# EAGLE design energy-management-input (EAGLE 6.3)
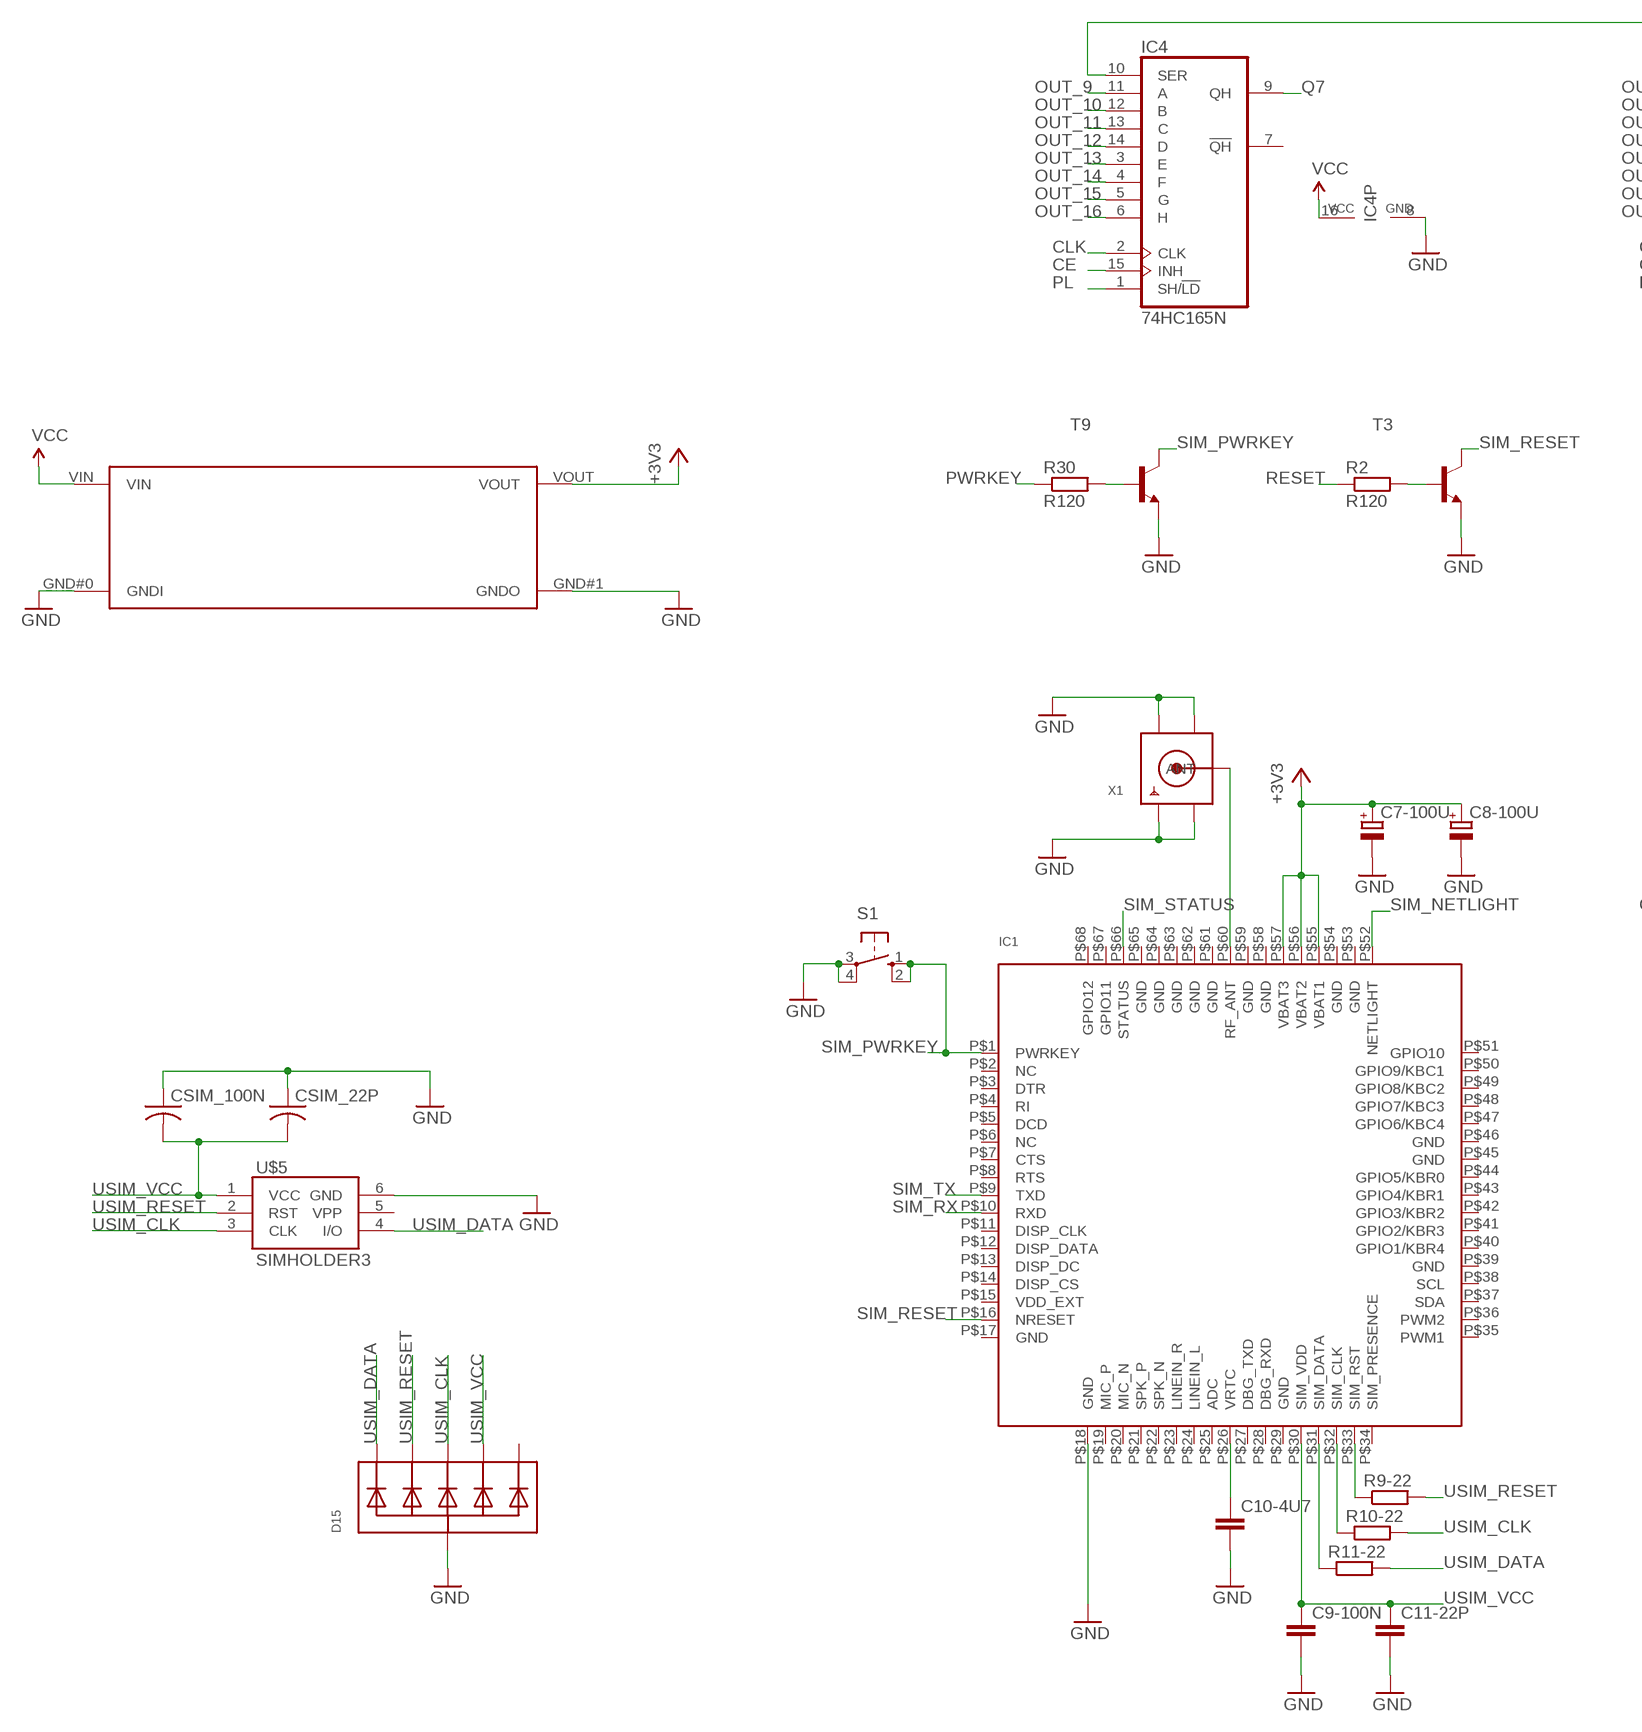
[diagram p0: schematic, sheet 1, part 1 of 2]
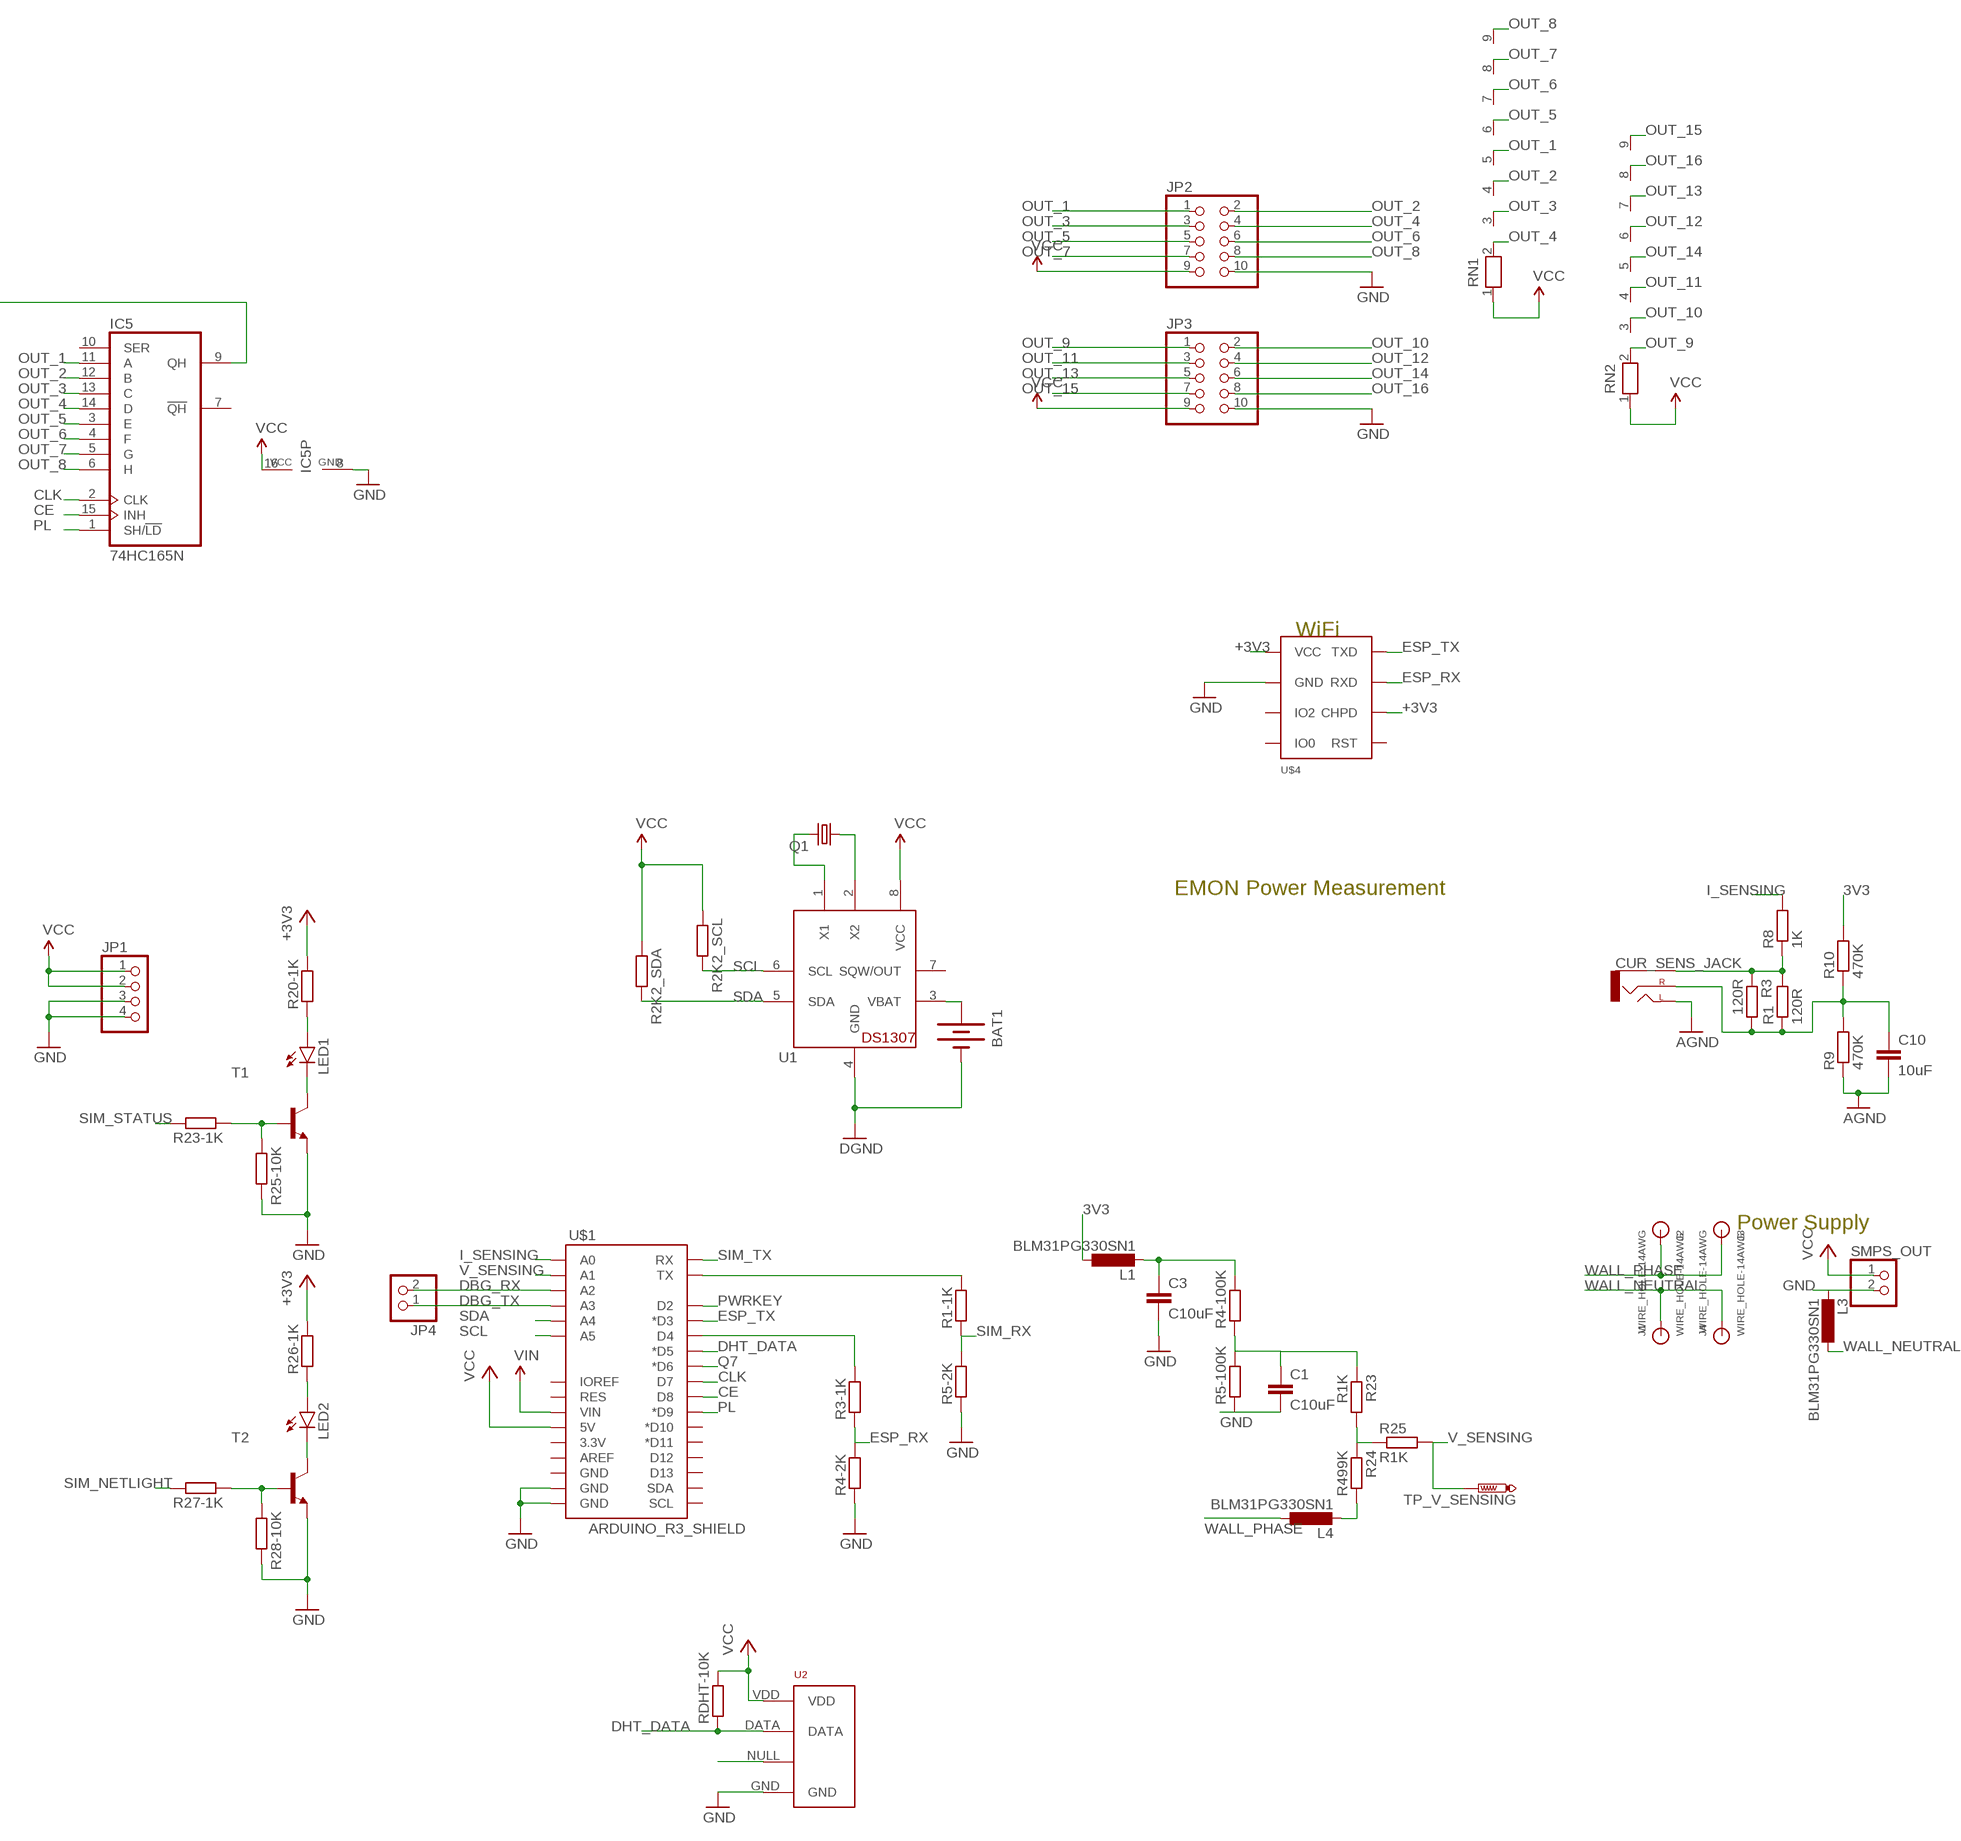
[diagram p1: schematic, sheet 1, part 2 of 2]

## Parts
BAT1  BATTERY20PTH  [BATTCOM_20MM_PTH]
C1  C10uF  C-EUC0805  [C0805]
C3  C10uF  C-EUC0805  [C0805]
C7-100U  CPOL-EU153CLV-0605  [153CLV-0605]
C8-100U  CPOL-EU153CLV-0605  [153CLV-0605]
C9-100N  C-EUC0603  [C0603]
C10  10uF  C-EUC0805  [C0805]
C10-4U7  C-EUC0603  [C0603]
C11-22P  C-EUC0603  [C0603]
CSIM_22P  C-USC0603K  [C0603K]
CSIM_100N  C-USC0603K  [C0603K]
CUR_SENS_JACK  AUDIO-JACKSMD2  [AUDIO-JACK-3.5MM-SMD]
D15  TVSARRAY_5LANE  [SOT363]
IC1  GSM_SIM900_LITERAL  [SIM900_SMT]
IC4  74HC165N  [DIL16]
IC5  74HC165N  [DIL16]
J1  WIRE_HOLE-14AWG  [WIRE_HOLE-14AWG]
J2  WIRE_HOLE-14AWG  [WIRE_HOLE-14AWG]
J3  WIRE_HOLE-14AWG  [WIRE_HOLE-14AWG]
J4  WIRE_HOLE-14AWG  [WIRE_HOLE-14AWG]
JP1  PINHD-1X4  [1X04]
JP2  PINHD-2X5  [2X05]
JP3  PINHD-2X5  [2X05]
JP4  PINHD-1X2  [1X02]
L1  BLM31PG330SN1  L-EUL3216C  [L3216C]
L3  BLM31PG330SN1  L-EUL3216C  [L3216C]
L4  BLM31PG330SN1  L-EUL3216C  [L3216C]
LED1  LED-3MM-NO_SILK  [LED3MM-NS]
LED2  LED-3MM-NO_SILK  [LED3MM-NS]
Q1  CRYSTALTC26H  [TC26H]
R1  120R  R-EU_0204/7  [0204/7]
R1-1K  R-EU_R0603  [R0603]
R2  R120  R-EU_M0805  [M0805]
R2K2_SCL  R-EU_R0603  [R0603]
R2K2_SDA  R-EU_R0603  [R0603]
R3  120R  R-EU_R1206  [R1206]
R3-1K  R-EU_R0603  [R0603]
R4-2K  R-EU_R0603  [R0603]
R4-100K  R-EU_R0805  [R0805]
R5-2K  R-EU_R0603  [R0603]
R5-100K  R-EU_R0805  [R0805]
R8  1K  R-EU_R0805  [R0805]
R9  470K  R-EU_R0805  [R0805]
R9-22  R-EU_R0603  [R0603]
R10  470K  R-EU_R0805  [R0805]
R10-22  R-EU_R0603  [R0603]
R11-22  R-EU_R0603  [R0603]
R20-1K  R-EU_R0603  [R0603]
R23  R1K  R-EU_R0805  [R0805]
R23-1K  R-EU_R0603  [R0603]
R24  R499K  R-EU_R0805  [R0805]
R25  R1K  R-EU_R0805  [R0805]
R25-10K  R-EU_R0603  [R0603]
R26-1K  R-EU_R0603  [R0603]
R27-1K  R-EU_R0603  [R0603]
R28-10K  R-EU_R0603  [R0603]
R30  R120  R-EU_M0805  [M0805]
RDHT-10K  R-EU_R0603  [R0603]
RN1  RN08  [RN-9]
RN2  RN08  [RN-9]
S1  10-XX  [B3F-10XX]
SMPS_OUT  PINHD-1X2  [1X02]
T1  MMBT2222ALT1-NPN-SOT23-BEC  [SOT23-BEC]
T2  MMBT2222ALT1-NPN-SOT23-BEC  [SOT23-BEC]
T3  MMBT2222ALT1-NPN-SOT23-BEC  [SOT23-BEC]
T9  MMBT2222ALT1-NPN-SOT23-BEC  [SOT23-BEC]
TP_V_SENSING  PTR1PAD1-13  [P1-13]
U1  DS1307  [DIL08]
U2  RHT03_DHT-22_AM2302  [RHT03_DHT-22]
U$1  ARDUINO_R3_SHIELD  [UNO_R3_SHIELD]
U$2  DCDCMODULE  [DCDCMODULE]
U$4  ESP8266  [ESP8266]
U$5  SIMHOLDER3  [SIMHOLDER3]
X1  SMACONNECTOR  [SMA90_DIP]

## Nets
3V3: L1.1 R10.2
+3V3: C7-100U.+ C8-100U.+ IC1.P$55(VBAT1) IC1.P$56(VBAT2) IC1.P$57(VBAT3) R20-1K.2 R26-1K.2 U$2.VOUT U$4.CHPD U$4.VCC
AGND [gnd]: C10.2 CUR_SENS_JACK.TIP(LEFT) R9.1
CE: IC4.15(INH) IC5.15(INH) U$1.D8
CLK: IC4.2(CLK) IC5.2(CLK) U$1.D7
DBG_RX: JP4.2 U$1.A2
DBG_TX: JP4.1 U$1.A3
DHT_DATA: RDHT-10K.1 U2.DATA U$1.D5(*D5)
ESP_RX: R3-1K.1 R4-2K.2 U$4.RXD
ESP_TX: U$1.D3(*D3) U$4.TXD
GND: BAT1.2(-) C1.2 C3.2 C7-100U.- C8-100U.- C9-100N.2 C10-4U7.2 C11-22P.2 CSIM_22P.1 CSIM_100N.1 D15.2(A) IC1.P$18(GND) IC4.8(GND) IC5.8(GND) JP1.3 JP1.4 JP2.10 JP3.10 L3.2 R4-2K.1 R5-2K.1 R5-100K.1 R25-10K.2 R28-10K.2 S1.3(P) S1.4(P1) SMPS_OUT.2 T1.E T2.E T3.E T9.E U1.4(GND) U2.GND U$1.GND@0(GND) U$1.GND@1(GND) U$2.GND#0(GNDI) U$2.GND#1(GNDO) U$4.GND U$5.6(GND) X1.GND1 X1.GND2 X1.GND3 X1.GND4 ; supply symbol labelled DGND
I_SENSING: R8.2 U$1.A0
N$1: C3.1 L1.2 R4-100K.2
N$2: IC1.P$31(SIM_DATA) R11-22.1
N$3: IC1.P$32(SIM_CLK) R10-22.1
N$4: IC1.P$33(SIM_RST) R9-22.1
N$5: C10-4U7.1 IC1.P$26(VRTC)
N$6: IC1.P$60(RF_ANT) X1.ANTENNA(ANT)
N$7: R1-1K.2 U$1.TX
N$8: LED1.A R20-1K.1
N$9: LED1.K(C) T1.C
N$10: R23-1K.1 R25-10K.1 T1.B
N$11: LED2.A R26-1K.1
N$12: LED2.K(C) T2.C
N$13: R27-1K.1 R28-10K.1 T2.B
N$14: R30.2 T9.B
N$15: R2.2 T3.B
N$16: Q1.1 U1.2(X2)
N$17: R3-1K.2 U$1.D4
N$19: Q1.2 U1.1(X1)
N$20: C1.1 R4-100K.1 R5-100K.2 R23.1
N$21: R23.2 R24.1 R25.1
N$22: L4.2 R24.2
N$23: BAT1.1(+) U1.3(VBAT)
N$25: CUR_SENS_JACK.SLEEVE R1.2 R3.1 R8.1
N$26: C10.1 CUR_SENS_JACK.RING(RIGHT) R1.1 R3.2 R9.2 R10.1
N$32: U2.NULL
N$50: IC4.10(SER) IC5.9(QH)
OUT_1: IC5.11(A) JP2.1 RN1.5
OUT_2: IC5.12(B) JP2.2 RN1.4
OUT_3: IC5.13(C) JP2.3 RN1.3
OUT_4: IC5.14(D) JP2.4 RN1.2
OUT_5: IC5.3(E) JP2.5 RN1.6
OUT_6: IC5.4(F) JP2.6 RN1.7
OUT_7: IC5.5(G) JP2.7 RN1.8
OUT_8: IC5.6(H) JP2.8 RN1.9
OUT_9: IC4.11(A) JP3.1 RN2.2
OUT_10: IC4.12(B) JP3.2 RN2.3
OUT_11: IC4.13(C) JP3.3 RN2.4
OUT_12: IC4.14(D) JP3.4 RN2.6
OUT_13: IC4.3(E) JP3.5 RN2.7
OUT_14: IC4.4(F) JP3.6 RN2.5
OUT_15: IC4.5(G) JP3.7 RN2.9
OUT_16: IC4.6(H) JP3.8 RN2.8
PL: IC4.1(SH/!LD) IC5.1(SH/!LD) U$1.D9(*D9)
PWRKEY: R30.1 U$1.D2
Q7: IC4.9(QH) U$1.D6(*D6)
RESET: R2.1
SCL: R2K2_SCL.2 U1.6(SCL) U$1.A5
SDA: R2K2_SDA.2 U1.5(SDA) U$1.A4
SIM_NETLIGHT: IC1.P$52(NETLIGHT) R27-1K.2
SIM_PWRKEY: IC1.P$1(PWRKEY) S1.1(S) S1.2(S1) T9.C
SIM_RESET: IC1.P$16(NRESET) T3.C
SIM_RX: IC1.P$10(RXD) R1-1K.1 R5-2K.2
SIM_STATUS: IC1.P$66(STATUS) R23-1K.2
SIM_TX: IC1.P$9(TXD) U$1.RX
USIM_CLK: D15.4(C3) R10-22.2 U$5.3(CLK)
USIM_DATA: D15.1(C1) R11-22.2 U$5.4(I/O)
USIM_RESET: D15.3(C2) R9-22.2 U$5.2(RST)
USIM_VCC: C9-100N.1 C11-22P.1 CSIM_22P.2 CSIM_100N.2 D15.5(C4) IC1.P$30(SIM_VDD) U$5.1(VCC)
V_SENSING: R25.2 TP_V_SENSING.TP U$1.A1
VCC: IC4.16(VCC) IC5.16(VCC) JP1.1 JP1.2 JP2.9 JP3.9 R2K2_SCL.1 R2K2_SDA.1 RDHT-10K.2 RN1.1 RN2.1 SMPS_OUT.1 U1.8(VCC) U2.VDD U$1.5V U$2.VIN
VIN: U$1.VIN
WALL_NEUTRAL: J1.P$1 J4.P$1 L3.1
WALL_PHASE: J2.P$1 J3.P$1 L4.1
Unconnected: D15.6(C5) IC1.P$2(NC) IC1.P$3(DTR) IC1.P$4(RI) IC1.P$5(DCD) IC1.P$6(NC) IC1.P$7(CTS) IC1.P$8(RTS) IC1.P$11(DISP_CLK) IC1.P$12(DISP_DATA) IC1.P$13(DISP_DC) IC1.P$14(DISP_CS) IC1.P$15(VDD_EXT) IC1.P$19(MIC_P) IC1.P$20(MIC_N) IC1.P$21(SPK_P) IC1.P$22(SPK_N) IC1.P$23(LINEIN_R) IC1.P$24(LINEIN_L) IC1.P$25(ADC) IC1.P$27(DBG_TXD) IC1.P$28(DBG_RXD) IC1.P$34(SIM_PRESENCE) IC1.P$35(PWM1) IC1.P$36(PWM2) IC1.P$37(SDA) IC1.P$38(SCL) IC1.P$40(GPIO1/KBR4) IC1.P$41(GPIO2/KBR3) IC1.P$42(GPIO3/KBR2) IC1.P$43(GPIO4/KBR1) IC1.P$44(GPIO5/KBR0) IC1.P$47(GPIO6/KBC4) IC1.P$48(GPIO7/KBC3) IC1.P$49(GPIO8/KBC2) IC1.P$50(GPIO9/KBC1) IC1.P$51(GPIO10) IC4.7(!QH) IC5.7(!QH) IC5.10(SER) U1.7(SQW/OUT) U$1.3.3V U$1.AREF U$1.D10(*D10) U$1.D11(*D11) U$1.D12 U$1.D13 U$1.GND@2(GND) U$1.IOREF U$1.RES U$1.SCL U$1.SDA U$4.IO0 U$4.IO2 U$4.RST U$5.5(VPP)

## Notes on the sheet
- WiFi
- EMON Power Measurement
- Power Supply

## Power pins joined to a net without a drawn wire
GND: IC1.P$17(GND) IC1.P$29(GND) IC1.P$39(GND) IC1.P$45(GND) IC1.P$46(GND) IC1.P$53(GND) IC1.P$54(GND) IC1.P$58(GND) IC1.P$59(GND) IC1.P$61(GND) IC1.P$62(GND) IC1.P$63(GND) IC1.P$64(GND) IC1.P$65(GND)
GPIO11: IC1.P$67(GPIO11)
GPIO12: IC1.P$68(GPIO12)

## Library data of the parts
BAT1 = SparkFun-Electromechanical:BATTERY: Battery Holders Various common sizes : AA, AAA, 20mm coin cell and 12mm coin cell. 20MM_4LEGS, BATT-10373
C1 C3 C10 = resistor:C-EU: CAPACITOR, European symbol
C7-100U C8-100U = rcl:CPOL-EU: POLARIZED CAPACITOR, European symbol
C9-100N C10-4U7 C11-22P = rcl:C-EU: CAPACITOR, European symbol
CSIM_22P CSIM_100N = rcl:C-US: CAPACITOR, American symbol
CUR_SENS_JACK = SparkFun-Connectors:AUDIO-JACK: 3.5mm Audio Jack Simple 3.5mm common PCB mount audio jack. SKU: PRT-08032; PROD_ID: CONN-10353
D15 = microbuilder:TVSARRAY_5LANE: Voltage Transient Suppressor Array SOT363 SMF05C - 100W 5V: Digikey - SMF05CT1GOSCT-ND
IC1 = microbuilder:GSM_SIM900_LITERAL: SIM900 Quad-Band GSM/GPRS Module Power Supply: 3.2-4.8V Temperature Range: -30°C-+80°C Bands: GSM 850, EGSM 900, DCS 1800, PCS 1900
IC4 IC5 = 74xx-eu:74*165: 8-bit parallel load SHIFT REGISTER
J1-J4 = powercube:WIRE_HOLE-14AWG: Solder point for 14AWG wire
JP1 = pinhead:PINHD-1X4: PIN HEADER
JP2 JP3 = pinhead:PINHD-2X5: PIN HEADER
JP4 SMPS_OUT = pinhead:PINHD-1X2: PIN HEADER
L1 L3 L4 = resistor:L-EU: INDUCTOR, European symbol
LED1 LED2 = SparkFun-LED:LED: LEDs Standard schematic elements and footprints for 5mm, 3mm, 1206, and 0603 sized LEDs. 5mm - Spark Fun Electronics SKU : COM-00529 (and others)
Q1 = crystal:CRYSTAL: CRYSTAL; OC_FARNELL: unknown; OC_NEWARK: unknown
R1 R1-1K R2K2_SCL R2K2_SDA R3-1K R4-2K R5-2K R9-22 R10-22 R11-22 R20-1K R23-1K R25-10K R26-1K R27-1K R28-10K RDHT-10K = rcl:R-EU_: RESISTOR, European symbol
R2 R3 R4-100K R5-100K R8-R10 R23-R25 R30 = resistor:R-EU_: RESISTOR, European symbol
RN1 RN2 = resistor-net:RN08: RESISTOR NETWORK; OC_FARNELL: unknown; OC_NEWARK: unknown
S1 = switch-omron:10-XX: OMRON SWITCH; MPN: B3F-1000; OC_FARNELL: 176432; OC_NEWARK: 36M3542
T1 T2 = transistor:*-NPN-: NPN Transistror BF959 corrected 2008.03.06
T3 T9 = transistor-neu-to92:*-NPN-: NPN Transistror BF959 corrected 2008.03.06
TP_V_SENSING = testpad:PTR1: TEST PIN
U1 = adafruit:DS1307: DS1307 Real time clock (RTC) with battery backup ability. Talk to it via i2c
U2 = RHT03_DHT-22_AM2302:RHT03_DHT-22_AM2302: RHT03 / DHT-22 / AM2302 Packages and symbol for the RHT03 / DHT-22 relative humidity and temperature sensor. Note: The AM2302 is a wired version of the DHT-22 which typically requires less clearance and is thus provided as a separate package.; PROD_ID: SEN-10167
U$1 = SparkFun-Boards:ARDUINO_R3_SHIELD: Shield form compatible with the Arduino Uno R3.
U$2 = bontor:DCDCMODULE
U$4 = tigorcustom:ESP8266
U$5 = SparkFun:SIMHOLDER3
X1 = microbuilder:SMACONNECTOR: SMA Connector 90° DIP SMA Connector, 50 Ohm (4UConnector: 07259)

## Net classes
1 power: width 0.305 mm, drill 0.6 mm, clearance 0.254 mm
2 gnd: width 0.254 mm, drill 0.6 mm, clearance 0.254 mm

## Board
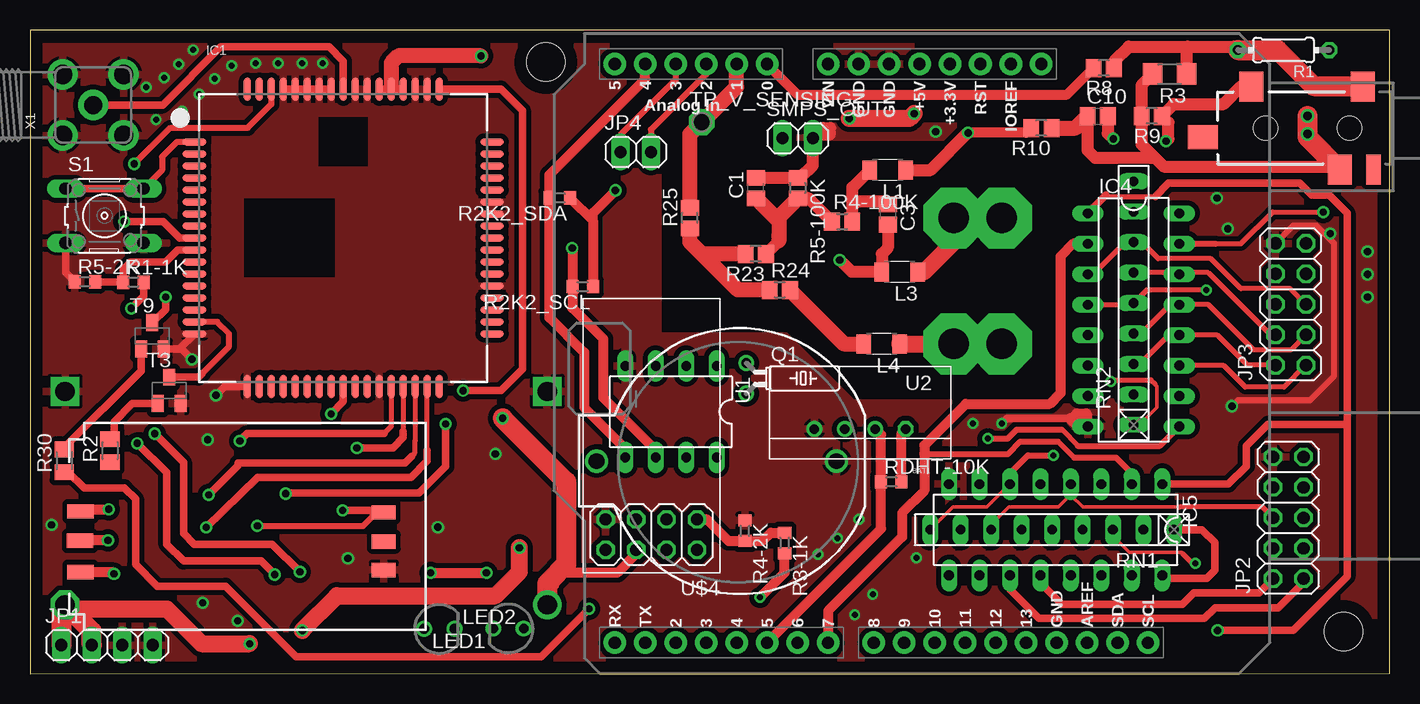
[diagram p2: board, top side]
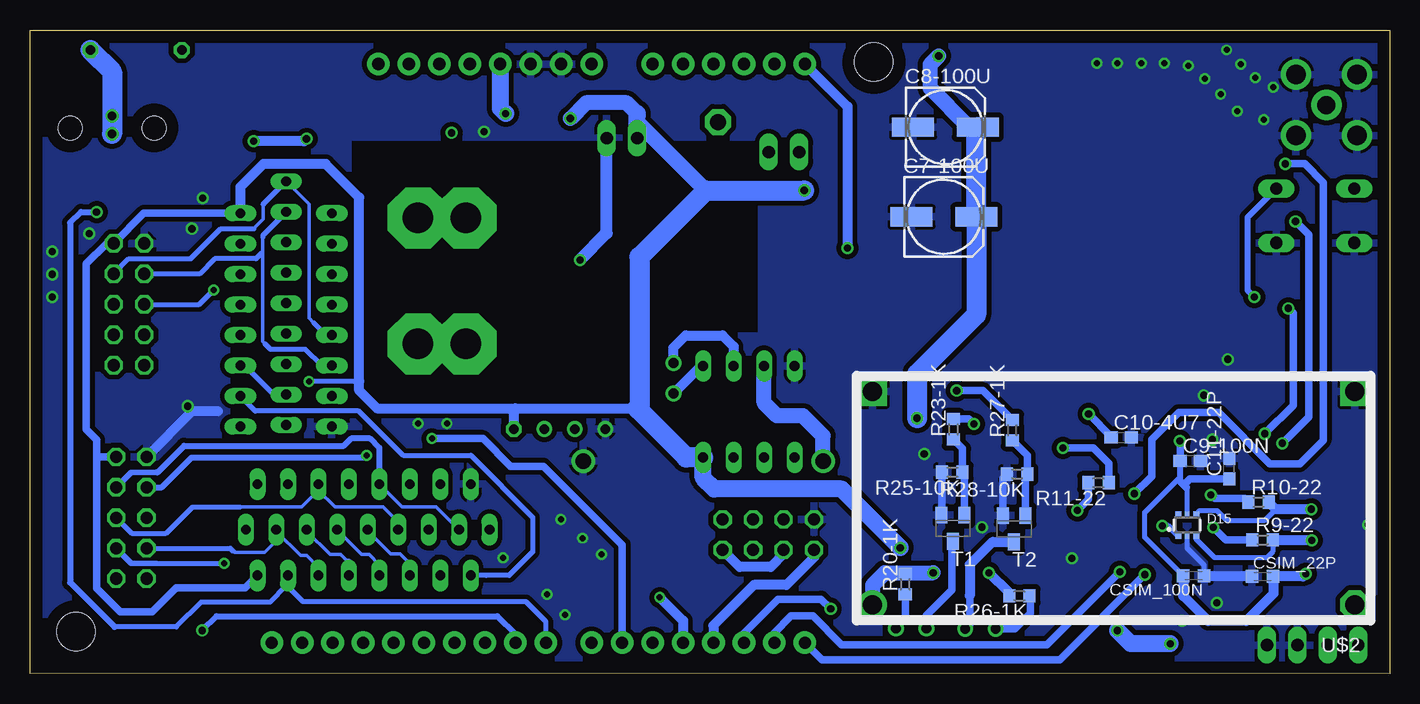
[diagram p3: board, bottom side, seen from below]

Size 113.35 x 53.66 mm. Coordinates in mm from the lower left corner, seen from the top.
Outline: 0,0 113.35,0.01 113.35,53.66 0,53.66 0,0
Copper layers (1*16): Top 0.035mm / dielectric 1.5mm / Bottom 0.035mm
Design rules "default": minimum track width 10mil, minimum drill 24mil, track to track 8mil, track to pad 8mil, pad to pad 8mil, via to via 8mil, smd to smd 8mil, copper to edge 40mil, drill to drill 8mil, minimum pad ring 10mil, minimum via ring 8mil, stop-mask expansion 4mil, vias tented up to drill 0mil, thermal gap 10mil
Holes 3.2 mm at 43,51 109.5,3.5

### Footprints (pad centres in the part's own frame; a part is rotated, then mirrored left to right if it is on the bottom)
BATTCOM_20MM_PTH = drill 1.3: 1 11.85,0; 2 -8.15,0
C0805 = smd 1.3 x 1.5: 1 -0.85,0; 2 0.85,0
153CLV-0605 = smd 3.5 x 1.6: + 2.7,0; - -2.7,0
C0603 = smd 1.1 x 1: 1 -0.85,0; 2 0.85,0
C0603K = smd 1.05 x 1.08: 1 -0.875,0; 2 0.875,0
AUDIO-JACK-3.5MM-SMD = smd 2 x 2.5: RING 4.3,3.45; SLEEVE 2.4,-3.45; TIP 11.7,-3.45 | smd 1.2 x 2.5: RSH 1.5,3.45 | smd 2.5 x 2: TSH 15.75,0.75 | hole 2: 3.5,0; 10.5,0
SOT363 = smd 0.5 x 0.5: 1 -0.75,-0.9; 3 0.75,-0.9; 4 0.75,0.9; 6 -0.75,0.9 | smd 0.4 x 0.5: 2 0,-0.9; 5 0,0.9
SIM900_SMT = smd 2 x 0.6: P$1 -12.4,8; P$2 -12.4,7; P$3 -12.4,6; P$4 -12.4,5; P$5 -12.4,4; P$6 -12.4,3; P$7 -12.4,2; P$8 -12.4,1; P$9 -12.4,0; P$10 -12.4,-1; P$11 -12.4,-2; P$12 -12.4,-3; P$13 -12.4,-4; P$14 -12.4,-5; P$15 -12.4,-6; P$16 -12.4,-7; P$17 -12.4,-8; P$35 12.4,-8; P$36 12.4,-7; P$37 12.4,-6; P$38 12.4,-5; P$39 12.4,-4; P$40 12.4,-3; P$41 12.4,-2; P$42 12.4,-1; P$43 12.4,0; P$44 12.4,1; P$45 12.4,2; P$46 12.4,3; P$47 12.4,4; P$48 12.4,5; P$49 12.4,6; P$50 12.4,7; P$51 12.4,8 | smd 0.6 x 2: P$18 -8,-12.4; P$19 -7,-12.4; P$20 -6,-12.4; P$21 -5,-12.4; P$22 -4,-12.4; P$23 -3,-12.4; P$24 -2,-12.4; P$25 -1,-12.4; P$26 0,-12.4; P$27 1,-12.4; P$28 2,-12.4; P$29 3,-12.4; P$30 4,-12.4; P$31 5,-12.4; P$32 6,-12.4; P$33 7,-12.4; P$34 8,-12.4; P$52 8,12.4; P$53 7,12.4; P$54 6,12.4; P$55 5,12.4; P$56 4,12.4; P$57 3,12.4; P$58 2,12.4; P$59 1,12.4; P$60 0,12.4; P$61 -1,12.4; P$62 -2,12.4; P$63 -3,12.4; P$64 -4,12.4; P$65 -5,12.4; P$66 -6,12.4; P$67 -7,12.4; P$68 -8,12.4
DIL16 = drill 0.813 long: 1 -8.89,-3.81; 2 -6.35,-3.81; 3 -3.81,-3.81; 4 -1.27,-3.81; 5 1.27,-3.81; 6 3.81,-3.81; 7 6.35,-3.81; 8 8.89,-3.81; 9 8.89,3.81; 10 6.35,3.81; 11 3.81,3.81; 12 1.27,3.81; 13 -1.27,3.81; 14 -3.81,3.81; 15 -6.35,3.81; 16 -8.89,3.81
WIRE_HOLE-14AWG = drill 2.54 pad 5.08 octagon: P$1 0,0
1X04 = drill 1.016 long: 1 -3.81,0; 2 -1.27,0; 3 1.27,0; 4 3.81,0
2X05 = drill 1.016 octagon: 1 -5.08,-1.27; 2 -5.08,1.27; 3 -2.54,-1.27; 4 -2.54,1.27; 5 0,-1.27; 6 0,1.27; 7 2.54,-1.27; 8 2.54,1.27; 9 5.08,-1.27; 10 5.08,1.27
1X02 = drill 1.016 long: 1 -1.27,0; 2 1.27,0
L3216C = smd 1.2 x 1.6: 1 -1.5,0; 2 1.5,0
LED3MM-NS = drill 0.813: A -1.27,0; K 1.27,0
TC26H = drill 0.813: 1 -1.27,0; 2 1.27,0
0204/7 = drill 0.813 octagon: 1 -3.81,0; 2 3.81,0
R0603 = smd 1 x 1.1: 1 -0.85,0; 2 0.85,0
M0805 = smd 1.3 x 1.6: 1 -0.95,0; 2 0.95,0
R1206 = smd 1.6 x 1.803: 1 -1.422,0; 2 1.422,0
R0805 = smd 1.3 x 1.5: 1 -0.85,0; 2 0.85,0
RN-9 = drill 0.813 long: 1 -10.16,0; 2 -7.62,0; 3 -5.08,0; 4 -2.54,0; 5 0,0; 6 2.54,0; 7 5.08,0; 8 7.62,0; 9 10.16,0
B3F-10XX = drill 1.016 long: 1 -3.251,2.261; 2 3.251,2.261; 3 -3.251,-2.261; 4 3.251,-2.261
SOT23-BEC = smd 1 x 1.4: B -0.95,-1.1; C 0,1.1; E 0.95,-1.1
P1-13 = drill 1.321 pad 2.159 octagon: TP 0,0
DIL08 = drill 0.813 long: 1 -3.81,-3.81; 2 -1.27,-3.81; 3 1.27,-3.81; 4 3.81,-3.81; 5 3.81,3.81; 6 1.27,3.81; 7 -1.27,3.81; 8 -3.81,3.81
RHT03_DHT-22 = drill 0.8: DATA -1.27,0; GND 3.81,0; NULL 1.27,0 | drill 0.8 octagon: VDD -3.81,0
UNO_R3_SHIELD = drill 1.016 pad 1.88: 3.3V 50.8,26.67; 5V 50.8,29.21; A0 50.8,41.91; A1 50.8,44.45; A2 50.8,46.99; A3 50.8,49.53; A4 50.8,52.07; A5 50.8,54.61; AREF 2.54,15.24; D2 2.54,49.53; D3 2.54,46.99; D4 2.54,44.45; D5 2.54,41.91; D6 2.54,39.37; D7 2.54,36.83; D8 2.54,33.02; D9 2.54,30.48; D10 2.54,27.94; D11 2.54,25.4; D12 2.54,22.86; D13 2.54,20.32; GND@0 50.8,31.75; GND@1 50.8,34.29; GND@2 2.54,17.78; IOREF 50.8,21.59; NC 50.8,19.05; RES 50.8,24.13; RX 2.54,54.61; SCL 2.54,10.16; SDA 2.54,12.7; TX 2.54,52.07; VIN 50.8,36.83
DCDCMODULE = drill 1.6 square: GND#0 1.7,1.7; GND#1 41.9,1.7 | drill 1.6 octagon: VIN 1.7,19.5 | drill 1.6: VOUT 41.9,19.5
ESP8266 = drill 1.016 octagon: CHPD 1.27,1.27; GND 3.81,-1.27; IO0 -1.27,-1.27; IO2 1.27,-1.27; RST -1.27,1.27; RXD -3.81,-1.27; TXD 3.81,1.27; VCC -3.81,1.27
SIMHOLDER3 = smd 2.2 x 1.2: 1 0.95,4.81; 2 0.91,7.41; 3 0.95,9.86 | smd 2 x 1.2: 4 26.2,9.78; 5 26.22,7.34; 6 26.22,4.98
SMA90_DIP = drill 1.5 pad 2.54: ANTENNA 0,0 | drill 1.6 pad 2.54: GND1 -2.54,2.54; GND2 2.54,2.54; GND3 -2.54,-2.54; GND4 2.54,-2.54

### Placement (x,y rotation side)
BAT1  59.08,17.73 180 top
C1  60.5,40.5 90 top
C3  71.5,38.3 270 top
C7-100U  37.17,38.1 0 bottom
C8-100U  37.03,45.58 0 bottom
C9-100N  16.62,17.75 0 bottom
C10  89,46.5 0 top
C10-4U7  22.38,19.7 0 bottom
C11-22P  13.38,17.09 90 bottom
CSIM_22P  10.61,8.1 0 bottom
CSIM_100N  16.35,8.17 180 bottom
CUR_SENS_JACK  113.5,45.5 180 top
D15  16.89,12.39 0 bottom
IC1  26.12,36.34 0 top
IC4  92,29.5 270 top
IC5  85.5,12 180 top
J1  77,38 90 top
J2  77,27.5 0 top
J3  81,27.5 90 top
J4  81,38 90 top
JP1  6.42,2.38 0 top
JP2  104.9,13 90 top
JP3  105.1,30.8 90 top
JP4  50.5,43.5 0 top
L1  71.5,42 180 top
L3  72.5,33.5 180 top
L4  71,27.5 180 top
LED1  39.89,3.76 180 top
LED2  34.12,3.74 0 top
Q1  59.71,24.63 270 top
R1  104.5,52 180 top
R1-1K  8.63,32.64 0 top
R2  6.66,18.6 90 top
R2K2_SCL  46.07,32.27 180 top
R2K2_SDA  44.16,39.67 180 top
R3  95,50 180 top
R3-1K  62.91,10.9 270 top
R4-2K  59.6,11.91 270 top
R4-100K  67.7,37.7 0 top
R5-2K  4.58,32.68 0 top
R5-100K  64,40.5 270 top
R8  89.5,50.5 180 top
R9  93.5,46.5 180 top
R9-22  10.59,11.15 0 bottom
R10  84.3,45.5 180 top
R10-22  10.93,14.3 0 bottom
R11-22  24.28,15.92 180 bottom
R20-1K  40.39,7.46 90 bottom
R23  60.5,35 180 top
R23-1K  36.37,20.37 90 bottom
R24  62.5,32 0 top
R25  55,38 90 top
R25-10K  36.46,16.8 180 bottom
R26-1K  30.87,6.49 180 bottom
R27-1K  31.46,20.3 90 bottom
R28-10K  31.06,16.64 180 bottom
R30  2.85,17.75 90 top
RDHT-10K  71.8,16 0 top
RN1  85.2,12 180 top
RN2  92,30.9 90 top
S1  6.21,38.18 0 top
SMPS_OUT  64,44.65 0 top
T1  36.41,12.12 180 bottom
T2  31.31,12.08 180 bottom
T3  11.6,23.62 0 top
T9  10.2,28.17 0 top
TP_V_SENSING  56,46 0 top
U1  53.43,21.84 180 top
U2  69.2,20.4 180 top
U$1  103.36,0.04 90 top
U$2  1.22,25.24 180 bottom
U$4  51.8,11.59 180 top
U$5  3.26,3.67 0 top
X1  5.27,47.42 90 top

### Tracks (layer width: path | path; a pad name or v marks a point on that pad's centre or on a via)
3V3  (via drill 0.6)
  Top 0.813: R10.2 83.05,45.1 v78.2,45.1
  Top 1.016: L1.1 75.1,42 v78.2,45.1
+3V3  (via drill 0.6)
  Top 0.61: IC1.P$57 IC1.P$56 IC1.P$55
  Top 0.813: v33.4,8.41 v38.05,8.41 | U$4.CHPD 50.53,9.97 48.97,8.41 44.13,8.41 43.32,7.6
  Top 1.27: v37.6,51.51 30.7,51.51 30.12,50.93 IC1.P$56
  Top 1.676: v39.4,21.3 44.7,16 44.7,9.1 43.25,7.65 | 43.25,7.65 43.12,7.52 U$2.VOUT | 43.32,7.6 43.27,7.65 43.25,7.65
  Bottom 0.61: 33.2,8.41 v33.4,8.41 | v38.05,8.41 40.17,8.41 R20-1K.2
  Bottom 0.813: R26-1K.2 31.72,6.73 v33.4,8.41 | U$4.VCC 54.2,8.9 51.6,8.9 50.53,9.97 U$4.CHPD
  Bottom 1: C7-100U.+ 34.82,38.1
  Bottom 1.27: C8-100U.+ 35.07,45.58 38.3,48.81 38.3,50.81 v37.6,51.51 | v38.05,8.41 42.09,8.41 43.12,7.38 U$2.VOUT
  Bottom 1.676: C8-100U.+ 34.47,45.44 C7-100U.+ 34.47,29.93 39.4,25 v39.4,21.3
AGND  (via drill 0.6)
  Top 1.016: CUR_SENS_JACK.TIP 100.95,48.95 99.5,47.5 95.35,47.5 R9.1 94.9,45.95 94.9,44.6 v94.7,44.4 | C10.2 89.85,45.05 v90.3,44.6
  Bottom 0.813: v90.3,44.6 90.5,44.4 v94.7,44.4
CE  (via drill 0.6)
  Top 0.406: 98.85,35.85 100.95,35.85 103.6,38.5 v107.8,38.5
  Top 0.5: IC4.15 98.85,35.85
  Bottom 0.406: 91.95,7.35 93.35,5.95 99.1,5.95 101.15,3.9 106.3,3.9 | 91.95,7.35 91.85,7.45 | U$1.D8 70.34,4.34 72,6 90.6,6 91.95,7.35
  Bottom 0.5: 106.3,3.9 110,7.6 110,37.6 109.1,38.5 v107.8,38.5 | IC5.15 91.85,7.45
CLK
  Top 0.406: 85.7,19.35 87.05,18
  Top 0.5: 87.05,18 90.55,18 91.85,16.7 IC5.2 | 74.55,18.35 74.6,18.3 81.5,18.3 82.55,19.35 85.7,19.35
  Top 0.813: IC4.2 86.95,35.85 85.9,34.8 85.9,23.4 85,22.5 78,22.5 74.55,19.05 74.55,18.35 74.55,15.25 72.7,13.4 72.7,11.4 66.53,5.23 U$1.D7
DBG_RX
  Top 0.5: U$1.A2 56.37,49.97 51.77,45.37 JP4.2
DBG_TX
  Top 0.5: U$1.A3 53.83,49.53 49.23,44.93 JP4.1
DHT_DATA
  Top 0.813: U2.DATA 70.95,19.92 RDHT-10K.1 70.95,12.08 U$1.D5
ESP_RX
  Top 0.813: R3-1K.1 61.75,11.75 61.06,11.06 R4-2K.2 58.24,11.06 56.44,12.86 U$4.RXD
ESP_TX
  Bottom 0.813: U$4.TXD 47.99,9.71 50.3,7.4 53,7.4 56.4,4 56.37,3.97 U$1.D3
GND  (via drill 0.5, 0.6)
  Top 0.5: JP3.10 105.35,37.4 107.2,37.4 108.7,35.9 108.7,24.8 106.7,22.8 100.7,22.8 v100.2,22.3
  Top 0.61: IC1.P$65 IC1.P$64 IC1.P$63 IC1.P$62 IC1.P$61 | R5-2K.1 2.96,33.45 S1.3 | IC1.P$17 12.45,27.07 | 12.45,27.07 T9.E | IC1.P$18 16.23,23.94 v15.5,23.21 | v13.5,26.21 12.64,27.07 12.45,27.07 | v81,20.85 81.45,21.3 86.7,21.3
  Top 0.813: 88.19,20.71 IC4.8 88.1,20.7 88.1,21.65 88.05,21.7 87.25,21.7 86.85,21.3 | 88.2,20.75 88.15,20.7 88.15,20.6 88,20.75 87.25,20.75 86.7,21.3 86.85,21.3 | 86.85,21.3 87.5,21.3 87.55,21.25 87.55,21.4 87.4,21.55 87.4,21.35 87.3,21.25
  Top 1.016: C1.2 R5-100K.1 | R5-100K.1 64.12,41.35 | v67.5,34.5 68.5,33.5 L3.2 71,35 71.5,35.5 C3.2 | R5-100K.1 64.24,41.35 65.27,42.38 SMPS_OUT.2 66.12,45.5 66.7,45.5 66.65,45.45 66.65,44.95 65.6,44.95 65.85,45.2 66.2,45.2
  Bottom 0.406: CSIM_100N.1 15.47,9.04 16.89,10.45 D15.2
  Bottom 0.5: v100.2,22.3 v100.2,22.29 99.81,21.9
  Bottom 0.61: T1.E 37.31,13.27 R25-10K.2 | T2.E 32.26,16.29 R28-10K.2
  Bottom 0.813: CSIM_22P.1 15.4,8.1 CSIM_100N.1 | JP2.10 99.81,21.9 97.7,21.9
  Bottom 1.016: SMPS_OUT.2 65.27,36.73 v67.5,34.5
  other vias: 14.4,5.91 9.7,48.91 11.2,49.71 12.4,50.81 13.6,52.01 10.5,46.21 12.7,46.91 14.1,48.31 15.4,49.61 16.8,50.71 18.8,50.91 20.7,50.91 22.7,50.91 24.4,50.91 38.8,18.31 34,12.21 26.5,9.61 14.8,19.51 1.8,12.41 17.3,4.41 75.5,45.2 111.5,33.3 108.4,36.7 111.5,35.2 111.5,31.4 78.6,20.85 73.9,9.65 98.95,39.65 99.85,37.1 70.25,6.6 68.75,4.9 65.7,9.95 67.3,11.3 69.1,12.85
  pour Bottom (isolate 0.406): 1,1.21 1,52.71 112.5,52.71 112.5,1.21
  pour Top (isolate 0.406): 1,1.21 112.5,1.21 112.5,52.71 1,52.71
GNDA
  cutout Top: 17.85,39.61 25.4,39.61 25.4,33.06 17.85,33.06
  cutout Top: 24.05,46.41 28.15,46.41 28.15,42.31 24.05,42.31
I_SENSING
  Top 0.813: U$1.A0 63.99,48.3 86.45,48.3 R8.2
N$1
  Top 1.016: R4-100K.2 68.55,39 | 68.55,39 68.55,40.55 L1.2 | 68.55,39 68.9,39.35 71.3,39.35 C3.1
N$2  (via drill 0.6)
  Top 0.406: IC1.P$31 31.12,20.18
  Top 0.61: v27.25,18.81 30.25,18.81 31.12,19.68 31.12,20.18
  Bottom 0.61: R11-22.1 23.43,17.54 24.7,18.81 v27.25,18.81
N$3  (via drill 0.6)
  Top 0.406: IC1.P$32 32.12,19.43 32.1,19.41 32.1,18.41 31.8,18.11
  Top 0.61: 31.8,18.11 31.25,17.56 17.35,17.56 17.35,17.35 v14.9,14.9
  Bottom 0.61: v14.9,14.9 14.6,14.6 12.08,14.6 R10-22.1
N$4  (via drill 0.6)
  Top 0.406: 33.12,18.63 IC1.P$33
  Top 0.61: 33.12,18.63 33.12,17.73 31.75,16.36 18.96,16.36 v14.7,12.2
  Bottom 0.61: 11.48,11.11 R9-22.1 13.65,11.15 v14.7,12.2
N$5  (via drill 0.6)
  Top 0.61: IC1.P$26 26.12,22.68 v25.1,21.66
  Bottom 0.61: v25.1,21.66 23.23,19.79 C10-4U7.1
N$6
  Top 0.61: X1.ANTENNA 11.06,47.42 15.9,52.26 24.95,52.26 26.12,51.09 IC1.P$60
N$7  (via drill 0.6)
  Top 0.61: R1-1K.2 9.48,31.49 v8.45,30.46 | v10.4,20.01 12.8,17.61 12.8,11.7 13.7,10.8 20.2,10.8 v22.5,8.5
  Bottom 0.61: v8.45,30.46 8.05,30.06 8.05,22.36 v10.4,20.01 | U$1.TX 51.29,3.42 49.9,4.81 48.1,4.81 45.7,2.41 28.59,2.41 v22.5,8.5
N$8
  Bottom 0.61: R20-1K.1 40.39,4.79 41.16,4.02 LED1.A
N$9
  Bottom 0.61: T1.C arc-90 36.5,10.93 36.5,7 38.62,4.88 LED1.K
N$10
  Bottom 0.61: T1.B 35.46,16.65 R25-10K.1 35.61,18.76 R23-1K.1
N$11
  Bottom 0.61: 29.95,6.42 29.95,5.05 31.26,3.74 LED2.A
  Bottom 0.813: R26-1K.1 29.95,6.42
N$12
  Bottom 0.61: 33.18,10.98 33.02,10.98 | 35,6.5 35,4.13 LED2.K
  Bottom 0.813: T2.C 33.02,10.98 33.12,10.98 35,9.1 35,6.5
N$13
  Bottom 0.61: R27-1K.1 30.21,18.2 R28-10K.1 30.36,16.49 T2.B
N$14
  Top 0.61: T9.B 9.25,25.25 2.85,18.85 R30.2
N$15
  Top 0.61: R2.2 7,19.89 7,21 8.52,22.52 T3.B
N$16
  Bottom 0.813: Q1.1 59.71,27.19 58.7,28.2 55.6,28.2 54.7,27.3 U1.2
N$17  (via drill 0.5)
  Top 0.813: R3-1K.2 62.91,8.41 v60.85,6.35
  Bottom 0.813: U$1.D4 58.91,4.41 v60.85,6.35
N$19
  Bottom 0.813: Q1.2 57.42,25.65 U1.1
N$20
  Top 1.016: R4-100K.1 64.9,39.65 R5-100K.2 | R23.1 62.42,36.08 62.5,36.15
  Top 1.27: C1.1 62.42,37.73 | 62.42,37.73 62.42,36.5 62.42,36.08 | R5-100K.2 62.42,38.08 62.42,37.73
N$21
  Top 1.27: R24.1 59,32 56,35 | 56,35 55,36 R25.1 | R23.2 56,35
N$22
  Top 1.27: R24.2 67.85,27.5 L4.2
N$23
  Bottom 1.27: U1.3 52.16,22.56 51.1,21.5 48.9,21.5 47.23,19.83 BAT1.1
N$25
  Top 1.016: R8.1 90.4,50.55 90.4,51.1 91.6,52.3 96.5,52.3 | 96.5,52.3 100.39,52.3 R1.2 | R3.1 96.42,52.22 96.5,52.3
  Top 1.676: R1.2 104,52 107,49 111.05,49 CUR_SENS_JACK.SLEEVE
N$26  (via drill 0.7)
  Top 1.016: 108.65,41.5 CUR_SENS_JACK.RING 108.95,42.3 94.5,42.3 94.1,42.7 93.8,43 | R3.2 92.65,49.07 R9.2 92.65,44.15 93.8,43 | C10.1 88.15,43.65 88.8,43 93.8,43
  Top 1.27: R10.1 87.15,45.5 C10.1
  Top 1.676: CUR_SENS_JACK.RING 106.5,44.75 v106.5,45 v106.5,46.5
  Bottom 1.676: R1.1 106.5,50.19 v106.5,45
N$27
  cutout Top: 86.5,44.4 86.5,22.9 68.7,22.9 63.1,28.5 52.1,28.5 52.7,28.5 52.7,44.4
N$28
  cutout Bottom: 86.5,44.4 86.5,22.9 68.7,22.9 63.1,28.5 52.7,28.5 52.7,44.4
N$31
  cutout Top: 60,50 88,50 88,47 88,46 68,46 64,46
N$50
  Bottom 0.406: IC4.10 94.56,21.9 85.95,21.9 82.25,18.2 76.6,18.2 71.45,13.05 71.45,10.15 73.41,8.19 IC5.9 75.31,8.19
OUT_1
  Top 0.61: JP2.1 106.17,7.62 104.05,5.5 98.8,5.5 97.9,4.6 84.1,4.6 81.69,7.01 IC5.11
  Bottom 0.305: IC5.11 81.69,9.19 82.5,10 83.3,10 85.2,11.9 RN1.5
OUT_2
  Top 0.61: JP2.2 102.46,6.75 97,6.75 96.05,5.8 86,5.8 84.23,7.57 IC5.12
  Bottom 0.305: IC5.12 84.23,9.08 85.1,9.95 85.7,9.95 RN1.4
OUT_3  (via drill 0.5)
  Top 0.305: 96.1,10 96,10.1 91.65,10.1 90.28,11.47 RN1.3
  Top 0.406: v97.15,9.2 96.9,9.2 96.1,10
  Bottom 0.305: 86.77,9.27 87.45,9.95 88.35,9.95 90.28,11.88 RN1.3
  Bottom 0.406: 102.85,9.2 v97.15,9.2
  Bottom 0.45: 102.85,9.2 104.91,9.2 JP2.3
  Bottom 0.61: 86.77,9.27 IC5.13
OUT_4
  Bottom 0.305: IC5.14 89.31,8.86 90.3,9.85 90.8,9.85 92.82,11.87 RN1.2 92.82,11.08 93.8,10.1 96.3,10.1 96.4,10.2
  Bottom 0.406: JP2.4 96.66,10.46 96.4,10.2
OUT_5
  Bottom 0.305: RN1.6 82.66,12.66 83.9,13.9 87.92,13.9 89.31,15.29 90.7,13.9 95.85,13.9
  Bottom 0.406: JP2.5 104.87,11.7 102,11.7 99.8,13.9 95.85,13.9
  Bottom 0.5: IC5.3 89.31,15.29
OUT_6
  Top 0.305: RN1.7 80.12,12.42 81.6,13.9 85.74,13.9 86.77,14.93 | 95.85,13.9 87.75,13.9 86.77,14.88 IC5.4
  Top 0.406: JP2.6 102.73,13.9 95.85,13.9
  Top 0.61: 86.77,14.93 IC5.4
OUT_7
  Bottom 0.305: RN1.8 79.48,13.9 82.32,13.9 IC5.5
  Bottom 0.45: 102.8,16.8 104.91,16.8 JP2.7
  Bottom 0.5: 102.8,16.8 102.7,16.8 100.5,19 87.2,19 86.6,19.6 85,19.6 84.23,18.83 IC5.5
OUT_8  (via drill 0.5)
  Top 0.305: RN1.9 76.94,13.9 79.78,13.9 IC5.6
  Top 0.5: IC5.6 81.69,16.69 83.2,18.2 v85.3,18.2
  Bottom 0.5: JP2.8 102.36,15.54 99.9,18 85.6,18 v85.3,18.2
OUT_9
  Top 0.406: IC4.11 99.51,25.69 101.3,23.9 104.55,23.9 JP3.1
  Bottom 0.406: RN2.2 93.03,23.28 95.44,25.69 IC4.11
OUT_10
  Top 0.406: JP3.2 101.48,25.72 98.97,28.23 IC4.12 94.93,28.23 92.52,25.82 RN2.3
OUT_11
  Top 0.406: JP3.3 105.11,27 102,27 98.23,30.77 IC4.13 95.07,30.77 92.66,28.36 RN2.4
OUT_12
  Top 0.406: 95.9,33.44 98.21,33.44 103.39,28.26 JP3.4 | 95.9,33.44 RN2.6 | IC4.14 95.81,33.35 95.9,33.44
OUT_13
  Top 0.406: IC4.3 88.66,33.31 91.33,35.98 RN2.7 92.67,35.98 94.05,34.6 98.45,34.6 100.95,32.1 105.07,32.1 JP3.5
OUT_14  (via drill 0.5)
  Top 0.406: IC4.4 91.87,30.77 RN2.5 93.1,32 v98.05,32
  Bottom 0.406: JP3.6 99.25,30.8 v98.05,32
OUT_15
  Bottom 0.305: 94.7,37.1 93.9,37.9 93.9,39.1 | 89.7,29.25 90.1,29.65 90.1,39.16 RN2.9
  Bottom 0.406: JP3.7 105.11,34.6 99.95,34.6 97.45,37.1 94.7,37.1 | 93.9,39.1 93.9,39.16 RN2.9 | IC4.5 88.68,28.23 89.7,29.25
OUT_16
  Bottom 0.305: 94,35.1 93.95,35.15 | 93.95,35.15 93.95,35.35 93.95,36.4 | 93.75,27.5 93.95,27.7 93.95,35.15
  Bottom 0.406: 94,35.1 94.5,34.6 97.95,34.6 99.21,33.34 JP3.8 | RN2.8 92,38.5 93.95,36.55 93.95,36.4 | IC4.6 89.04,25.69 90.4,27.05 93.3,27.05 93.75,27.5
PL  (via drill 0.6)
  Top 0.406: 89.7,39.9 89.8,39.8 93.8,39.8
  Top 0.61: IC4.1 89.7,39.9 | IC5.1 99.91,15.81 101.4,17.3 101.4,19 103.2,20.8 109.8,20.8 | 109.8,20.8 109.8,38.4 108.3,39.9 106.85,39.9 105.85,40.9 94.9,40.9 93.8,39.8 | 109.8,20.8 109.8,8.1 105.3,3.6 v99,3.6
  Bottom 0.5: v99,3.6 97.8,4.8 74.4,4.8 72.88,3.28 U$1.D9
PWRKEY  (via drill 0.6)
  Top 0.61: R30.1 3.2,16.8 4.5,15.5 7.86,15.5 8.8,14.56 8.8,9.1 10.6,7.3 16.3,7.3 22.2,1.4 42.6,1.4 v46.6,5.4
  Bottom 0.61: U$1.D2 53.83,3.37 51,6.2 47.4,6.2 v46.6,5.4
Q7  (via drill 0.5)
  Top 0.406: 86,20.35 87.35,19
  Top 0.5: IC4.9 94.2,19 87.35,19 | v79.85,19.6 81.5,19.6 82.25,20.35 86,20.35
  Bottom 0.61: 63.99,2.99 U$1.D6 63.99,10.74 70.55,17.3 73.3,17.3 75.6,19.6 v79.85,19.6
SCL  (via drill 0.6)
  Top 0.813: U1.6 52.16,18.64 47.8,23 47.8,27.9 45.22,30.48 R2K2_SCL.2 45.22,35.48 v45.2,35.5
  Bottom 0.813: U$1.A5 45.2,47.29 v45.2,35.5
SDA
  Top 0.813: U$1.A4 51.29,49.59 43.31,41.61 R2K2_SDA.2 43.31,29.69 46.2,26.8 46.2,22.2 49.62,18.78 U1.5
SIM_NETLIGHT  (via drill 0.6)
  Top 0.61: IC1.P$52 39.27,48.74 41.05,46.96 41.05,25.4 39.25,23.6 v36.1,23.6
  Bottom 0.61: R27-1K.2 33.91,23.6 v36.1,23.6
SIM_PWRKEY  (via drill 0.6)
  Top 0.5: IC1.P$1 12.23,44.34 11,43.11 11,41.98 S1.2
  Top 0.61: S1.2 S1.1 | T9.C 11.3,30.37 v11.3,31.41
  Bottom 0.5: v11.3,31.41 11.85,31.96 11.85,38.05 S1.2
SIM_RESET
  Top 0.5: 14.36,25.02 16.6,27.26 16.6,28.36 15.62,29.34 IC1.P$16
  Top 0.61: 14.36,25.02 14.06,24.72 T3.C
SIM_RX
  Top 0.61: R5-2K.2 5.47,32.64 R1-1K.1 7.78,33.69 8.4,34.31 11.3,34.31 12.33,35.34 IC1.P$10
SIM_STATUS  (via drill 0.6)
  Top 0.5: IC1.P$66 20.12,47.48 18.15,45.51 11.7,45.51 v8.7,42.51
  Top 0.61: v34.65,20.81 34.65,17.26 32.45,15.06 21.35,15.06 v21.3,15.01
  Bottom 0.61: v8.7,42.51 7.1,42.51 5.55,40.96 5.55,19.46 7.51,17.5 10,17.5 14.26,21.76 17.6,21.76 19.85,19.51 19.85,16.46 v21.3,15.01 | R23-1K.2 35.06,21.22 v34.65,20.81
SIM_TX  (via drill 0.6)
  Top 0.61: IC1.P$9 12.47,36.34 11.1,37.71 v7.85,37.71 | v8.95,19.21 11.4,16.76 11.4,10.8 12.8,9.4 19.26,9.4 v20.4,8.26
  Bottom 0.61: v20.4,8.26 27.5,1.16 47.33,1.16 U$1.RX | v8.95,19.21 6.75,21.41 6.75,36.61 v7.85,37.71
USIM_CLK  (via drill 0.6)
  Top 0.813: U$5.3 4.39,13.71 v6.55,13.71
  Bottom 0.406: D15.4 15.83,13.6 14.4,13.6 13.6,12.8 10.4,12.8 9.49,13.71
  Bottom 0.813: v6.55,13.71 9.49,13.71 R10-22.2
USIM_DATA  (via drill 0.6)
  Top 0.5: v18.95,12.31 27.75,12.31 28.73,13.29 28.98,13.54
  Top 0.61: U$5.4 29.06,13.45 28.98,13.54 | v26.05,13.61 28.4,13.61 28.73,13.29
  Bottom 0.5: D15.1 18.46,12.31 v18.95,12.31
  Bottom 0.61: R11-22.2 25.13,14.53 v26.05,13.61
USIM_RESET  (via drill 0.6)
  Top 0.813: v6.5,11.11 4.2,11.11 U$5.2
  Bottom 0.406: R9-22.2 9.75,10.16 10.25,9.66 14.6,9.66 16.14,11.2 D15.3
  Bottom 0.813: v6.5,11.11 9.7,11.11 R9-22.2
USIM_VCC  (via drill 0.6)
  Top 0.406: IC1.P$30 30.12,20.63 29.5,20.01
  Top 0.61: 29.5,20.01 18.1,20.01 v17.5,19.41
  Top 0.813: U$5.1 6.83,8.48 v7,8.31
  Bottom 0.406: CSIM_100N.2 20.45,11.39 20.45,13.41 17.47,16.39 C9-100N.1 | D15.5 16.89,15.45 16.97,15.53
  Bottom 0.5: 17.38,15.94 17.47,16.03 C9-100N.1
  Bottom 0.61: C9-100N.1 17.47,19.38 v17.5,19.41 | 16.97,15.53 17.17,15.73 | 17.17,15.73 17.38,15.94 | 17.46,16.04 17.47,16.03 | C11-22P.1 16.66,16.24 17.17,15.73
  Bottom 0.813: CSIM_100N.2 17.23,6.49 15.14,4.4 11.96,4.4 9.7,6.66 9.7,8.06 CSIM_22P.2 7.21,8.1 v7,8.31
V_SENSING
  Top 1.27: 59,50.75 U$1.A1 58.91,48.91 TP_V_SENSING.TP 55,45 R25.2
VCC  (via drill 0.5, 0.6)
  Top 0.305: 93.8,24.15 93.95,24 93.95,22.2 92.49,20.74 RN2.1
  Top 0.406: v90.1,24.35 90.25,24.5 93.45,24.5 93.8,24.15
  Top 0.61: RN1.1 97.7,12 98.75,10.95 98.75,8.6 98.1,7.95 94.63,7.95 IC5.16
  Top 0.813: R2K2_SDA.1 46.92,37.76 | 46.92,37.76 R2K2_SCL.1 | 46.92,37.76 46.92,38.42 v48.8,40.3 | RDHT-10K.2 72.65,20.04 U2.VDD
  Top 1.422: v73.7,46.7 73.3,46.3 v68.3,46.3 | U$2.VIN 3.46,5.4 11.4,5.4 14.3,2.5 v18.3,2.5 | v22.7,3.6 25.6,6.5 38.8,6.5 40.8,8.5 v40.8,10.5
  Top 1.676: JP1.1 2.61,5.43 U$2.VIN 5.15,3.51 JP1.2
  Bottom 0.406: v90.1,24.35 90.05,24.4 85.9,24.4
  Bottom 0.61: 107.8,18.08 107.8,7.1 105.85,5.15 103.15,5.15 101.15,7.15 95.43,7.15 IC5.16 | 107.8,18.08 107.8,19.5 108.65,20.35 108.65,34.2 106.97,35.88 JP3.9 103.86,38.39 IC4.16 | JP2.9 107.8,18.08
  Bottom 0.813: 72.9,22.13 84.43,22.13 85.9,23.6 85.9,24.4 85.9,39.7 88.7,42.5 93.9,42.5 95.81,40.59 IC4.16 | 72.9,22.13 62.73,22.13 | U2.VDD 73.01,22.02 72.9,22.13
  Bottom 1.27: 57,40.3 62.73,46.03 62.73,46.5 | 62.73,46.73 63.6,47.6 67,47.6 v68.3,46.3
  Bottom 1.422: SMPS_OUT.1 62.73,46.5 62.73,46.73 | U$1.5V 74.15,47.15 v73.7,46.7 | v18.3,2.5 21.6,2.5 v22.7,3.6 | v40.8,10.5 45.7,15.4 56.3,15.4 57.24,16.34 U1.8
  Bottom 1.676: U1.8 58.63,18.03 62.55,21.95 | 62.55,21.95 62.73,22.13 | v48.8,40.3 57,40.3 62.55,34.75 62.55,21.95
WALL_NEUTRAL
  Top 1.016: L3.1 74.5,33.5
  Top 1.422: 74.5,33.5 79,38 | J1.P$1 79,38 | J4.P$1 79,38
WALL_PHASE
  Top 1.422: L4.1 J2.P$1 J3.P$1